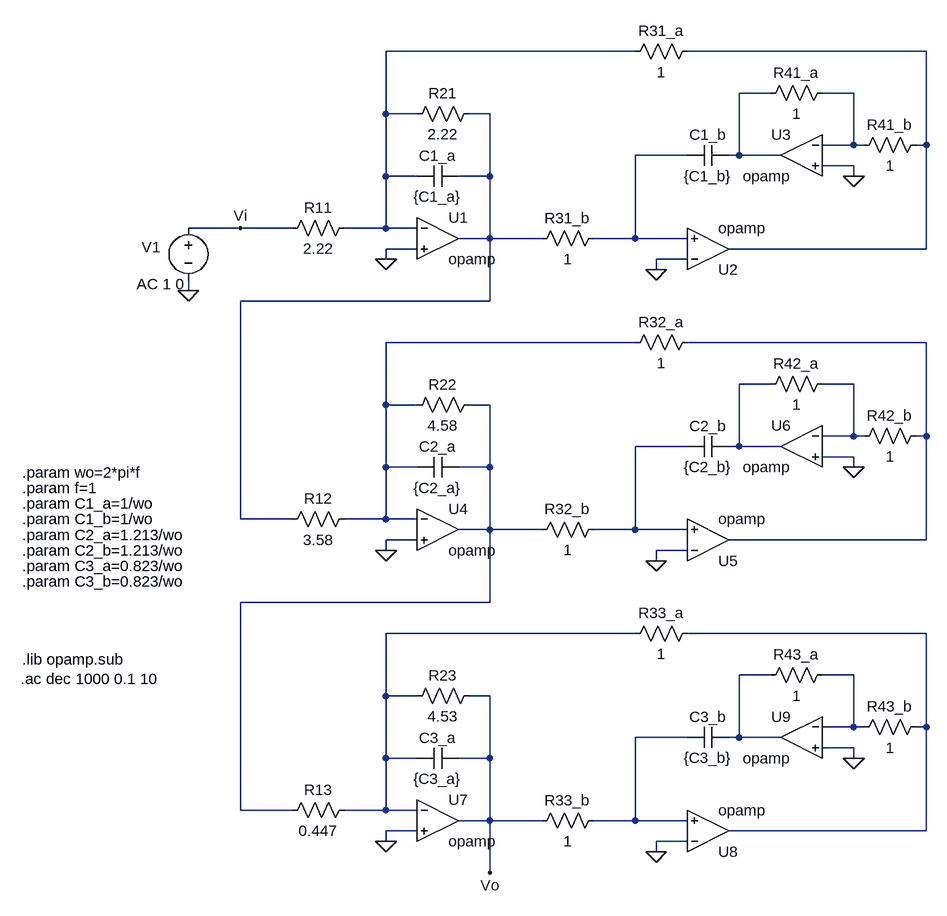
[diagram p0: schematic TS4_bis.asc]
TS4_bis.asc, the LTspice schematic file:
Version 4
SHEET 1 880 1344
WIRE 320 -16 -64 -16
WIRE 768 -16 400 -16
WIRE 528 48 480 48
WIRE 656 48 608 48
WIRE -64 80 -64 -16
WIRE -16 80 -64 80
WIRE 96 80 64 80
WIRE 656 128 656 48
WIRE 656 128 608 128
WIRE 672 128 656 128
WIRE 768 128 768 -16
WIRE 768 128 752 128
WIRE 400 144 320 144
WIRE 480 144 480 48
WIRE 480 144 464 144
WIRE 544 144 480 144
WIRE 656 160 608 160
WIRE -64 176 -64 80
WIRE -16 176 -64 176
WIRE 96 176 96 80
WIRE 96 176 48 176
WIRE 656 176 656 160
WIRE -288 256 -368 256
WIRE -208 256 -288 256
WIRE -64 256 -64 176
WIRE -64 256 -128 256
WIRE -16 256 -64 256
WIRE 96 272 96 176
WIRE 96 272 48 272
WIRE 176 272 96 272
WIRE 320 272 320 144
WIRE 320 272 256 272
WIRE 400 272 320 272
WIRE -16 288 -64 288
WIRE 768 288 768 128
WIRE 768 288 464 288
WIRE -64 304 -64 288
WIRE 400 304 352 304
WIRE 352 320 352 304
WIRE -368 352 -368 336
WIRE 96 368 96 272
WIRE 96 368 -288 368
WIRE 320 432 -64 432
WIRE 768 432 400 432
WIRE 528 496 480 496
WIRE 656 496 608 496
WIRE -64 528 -64 432
WIRE -16 528 -64 528
WIRE 96 528 64 528
WIRE 656 576 656 496
WIRE 656 576 608 576
WIRE 672 576 656 576
WIRE 768 576 768 432
WIRE 768 576 752 576
WIRE 400 592 320 592
WIRE 480 592 480 496
WIRE 480 592 464 592
WIRE 544 592 480 592
WIRE 656 608 608 608
WIRE -64 624 -64 528
WIRE -16 624 -64 624
WIRE 96 624 96 528
WIRE 96 624 48 624
WIRE 656 624 656 608
WIRE -288 704 -288 368
WIRE -208 704 -288 704
WIRE -64 704 -64 624
WIRE -64 704 -128 704
WIRE -16 704 -64 704
WIRE 96 720 96 624
WIRE 96 720 48 720
WIRE 176 720 96 720
WIRE 320 720 320 592
WIRE 320 720 256 720
WIRE 400 720 320 720
WIRE -16 736 -64 736
WIRE 768 736 768 576
WIRE 768 736 464 736
WIRE -64 752 -64 736
WIRE 400 752 352 752
WIRE 352 768 352 752
WIRE 96 832 96 720
WIRE 96 832 -288 832
WIRE 320 880 -64 880
WIRE 768 880 400 880
WIRE 528 944 480 944
WIRE 656 944 608 944
WIRE -64 976 -64 880
WIRE -16 976 -64 976
WIRE 96 976 64 976
WIRE 656 1024 656 944
WIRE 656 1024 608 1024
WIRE 672 1024 656 1024
WIRE 768 1024 768 880
WIRE 768 1024 752 1024
WIRE 400 1040 320 1040
WIRE 480 1040 480 944
WIRE 480 1040 464 1040
WIRE 544 1040 480 1040
WIRE 656 1056 608 1056
WIRE -64 1072 -64 976
WIRE -16 1072 -64 1072
WIRE 96 1072 96 976
WIRE 96 1072 48 1072
WIRE 656 1072 656 1056
WIRE -288 1152 -288 832
WIRE -208 1152 -288 1152
WIRE -64 1152 -64 1072
WIRE -64 1152 -128 1152
WIRE -16 1152 -64 1152
WIRE 96 1168 96 1072
WIRE 96 1168 48 1168
WIRE 176 1168 96 1168
WIRE 320 1168 320 1040
WIRE 320 1168 256 1168
WIRE 400 1168 320 1168
WIRE -16 1184 -64 1184
WIRE 768 1184 768 1024
WIRE 768 1184 464 1184
WIRE -64 1200 -64 1184
WIRE 400 1200 352 1200
WIRE 352 1216 352 1200
WIRE 96 1248 96 1168
FLAG -64 304 0
FLAG 352 320 0
FLAG 656 176 0
FLAG -64 752 0
FLAG 352 768 0
FLAG 656 624 0
FLAG -64 1200 0
FLAG 352 1216 0
FLAG 656 1072 0
FLAG 96 1248 Vo
FLAG -288 256 Vi
FLAG -368 352 0
SYMBOL cap 48 160 R90
WINDOW 0 0 32 VBottom 2
WINDOW 3 32 32 VTop 2
SYMATTR InstName C1_a
SYMATTR Value {C1_a}
SYMBOL res -112 240 R90
WINDOW 0 0 56 VBottom 2
WINDOW 3 32 56 VTop 2
SYMATTR InstName R11
SYMATTR Value 2.22
SYMBOL res 80 64 R90
WINDOW 0 0 56 VBottom 2
WINDOW 3 32 56 VTop 2
SYMATTR InstName R21
SYMATTR Value 2.22
SYMBOL res 416 -32 R90
WINDOW 0 0 56 VBottom 2
WINDOW 3 32 56 VTop 2
SYMATTR InstName R31_a
SYMATTR Value 1
SYMBOL res 272 256 R90
WINDOW 0 0 56 VBottom 2
WINDOW 3 32 56 VTop 2
SYMATTR InstName R31_b
SYMATTR Value 1
SYMBOL res 624 32 R90
WINDOW 0 0 56 VBottom 2
WINDOW 3 32 56 VTop 2
SYMATTR InstName R41_a
SYMATTR Value 1
SYMBOL res 768 112 R90
WINDOW 0 0 56 VBottom 2
WINDOW 3 32 56 VTop 2
SYMATTR InstName R41_b
SYMATTR Value 1
SYMBOL cap 400 128 M90
WINDOW 0 0 32 VBottom 2
WINDOW 3 32 32 VTop 2
SYMATTR InstName C1_b
SYMATTR Value {C1_b}
SYMBOL OpAmps\\opamp 16 208 R0
SYMATTR InstName U1
SYMBOL OpAmps\\opamp 432 352 M180
SYMATTR InstName U2
SYMBOL OpAmps\\opamp 576 80 M0
SYMATTR InstName U3
SYMBOL cap 48 608 R90
WINDOW 0 0 32 VBottom 2
WINDOW 3 32 32 VTop 2
SYMATTR InstName C2_a
SYMATTR Value {C2_a}
SYMBOL res -112 688 R90
WINDOW 0 0 56 VBottom 2
WINDOW 3 32 56 VTop 2
SYMATTR InstName R12
SYMATTR Value 3.58
SYMBOL res 80 512 R90
WINDOW 0 0 56 VBottom 2
WINDOW 3 32 56 VTop 2
SYMATTR InstName R22
SYMATTR Value 4.58
SYMBOL res 416 416 R90
WINDOW 0 0 56 VBottom 2
WINDOW 3 32 56 VTop 2
SYMATTR InstName R32_a
SYMATTR Value 1
SYMBOL res 272 704 R90
WINDOW 0 0 56 VBottom 2
WINDOW 3 32 56 VTop 2
SYMATTR InstName R32_b
SYMATTR Value 1
SYMBOL res 624 480 R90
WINDOW 0 0 56 VBottom 2
WINDOW 3 32 56 VTop 2
SYMATTR InstName R42_a
SYMATTR Value 1
SYMBOL res 768 560 R90
WINDOW 0 0 56 VBottom 2
WINDOW 3 32 56 VTop 2
SYMATTR InstName R42_b
SYMATTR Value 1
SYMBOL cap 400 576 M90
WINDOW 0 0 32 VBottom 2
WINDOW 3 32 32 VTop 2
SYMATTR InstName C2_b
SYMATTR Value {C2_b}
SYMBOL OpAmps\\opamp 16 656 R0
SYMATTR InstName U4
SYMBOL OpAmps\\opamp 432 800 M180
SYMATTR InstName U5
SYMBOL OpAmps\\opamp 576 528 M0
SYMATTR InstName U6
SYMBOL cap 48 1056 R90
WINDOW 0 0 32 VBottom 2
WINDOW 3 32 32 VTop 2
SYMATTR InstName C3_a
SYMATTR Value {C3_a}
SYMBOL res -112 1136 R90
WINDOW 0 0 56 VBottom 2
WINDOW 3 32 56 VTop 2
SYMATTR InstName R13
SYMATTR Value 0.447
SYMBOL res 80 960 R90
WINDOW 0 0 56 VBottom 2
WINDOW 3 32 56 VTop 2
SYMATTR InstName R23
SYMATTR Value 4.53
SYMBOL res 416 864 R90
WINDOW 0 0 56 VBottom 2
WINDOW 3 32 56 VTop 2
SYMATTR InstName R33_a
SYMATTR Value 1
SYMBOL res 272 1152 R90
WINDOW 0 0 56 VBottom 2
WINDOW 3 32 56 VTop 2
SYMATTR InstName R33_b
SYMATTR Value 1
SYMBOL res 624 928 R90
WINDOW 0 0 56 VBottom 2
WINDOW 3 32 56 VTop 2
SYMATTR InstName R43_a
SYMATTR Value 1
SYMBOL res 768 1008 R90
WINDOW 0 0 56 VBottom 2
WINDOW 3 32 56 VTop 2
SYMATTR InstName R43_b
SYMATTR Value 1
SYMBOL cap 400 1024 M90
WINDOW 0 0 32 VBottom 2
WINDOW 3 32 32 VTop 2
SYMATTR InstName C3_b
SYMATTR Value {C3_b}
SYMBOL OpAmps\\opamp 16 1104 R0
SYMATTR InstName U7
SYMBOL OpAmps\\opamp 432 1248 M180
SYMATTR InstName U8
SYMBOL OpAmps\\opamp 576 976 M0
SYMATTR InstName U9
SYMBOL voltage -368 240 R0
WINDOW 0 -72 45 Left 2
WINDOW 3 -80 74 Left 2
WINDOW 123 -80 102 Left 2
WINDOW 39 0 0 Left 0
SYMATTR InstName V1
SYMATTR Value ""
SYMATTR Value2 AC 1 0
TEXT -624 680 Left 2 !.param C1_a=1/wo
TEXT -624 632 Left 2 !.param wo=2*pi*f
TEXT -624 656 Left 2 !.param f=1
TEXT -624 704 Left 2 !.param C1_b=1/wo
TEXT -624 728 Left 2 !.param C2_a=1.213/wo
TEXT -624 752 Left 2 !.param C2_b=1.213/wo
TEXT -624 776 Left 2 !.param C3_a=0.823/wo
TEXT -624 800 Left 2 !.param C3_b=0.823/wo
TEXT -626 950 Left 2 !.ac dec 1000 0.1 10
TEXT -624 920 Left 2 !.lib opamp.sub

The netlist it stands for:
* TS4_bis.asc
C1_a N005 N001 {C1_a}
R11 N001 Vi 2.22
R21 N005 N001 2.22
R31_a N002 N001 1
R31_b N006 N005 1
R41_a N004 N003 1
R41_b N002 N004 1
C1_b N006 N003 {C1_b}
XU1 N001 0 N005 opamp Aol=100K GBW=10Meg  ; pins invin noninvin out
XU2 0 N006 N002 opamp Aol=100K GBW=10Meg  ; pins invin noninvin out
XU3 N004 0 N003 opamp Aol=100K GBW=10Meg  ; pins invin noninvin out
C2_a N011 N007 {C2_a}
R12 N007 N005 3.58
R22 N011 N007 4.58
R32_a N008 N007 1
R32_b N012 N011 1
R42_a N010 N009 1
R42_b N008 N010 1
C2_b N012 N009 {C2_b}
XU4 N007 0 N011 opamp Aol=100K GBW=10Meg  ; pins invin noninvin out
XU5 0 N012 N008 opamp Aol=100K GBW=10Meg  ; pins invin noninvin out
XU6 N010 0 N009 opamp Aol=100K GBW=10Meg  ; pins invin noninvin out
C3_a Vo N013 {C3_a}
R13 N013 N011 0.447
R23 Vo N013 4.53
R33_a N014 N013 1
R33_b N017 Vo 1
R43_a N016 N015 1
R43_b N014 N016 1
C3_b N017 N015 {C3_b}
XU7 N013 0 Vo opamp Aol=100K GBW=10Meg  ; pins invin noninvin out
XU8 0 N017 N014 opamp Aol=100K GBW=10Meg  ; pins invin noninvin out
XU9 N016 0 N015 opamp Aol=100K GBW=10Meg  ; pins invin noninvin out
V1 Vi 0 AC 1 0
.param C1_a=1/wo
.param wo=2*pi*f
.param f=1
.param C1_b=1/wo
.param C2_a=1.213/wo
.param C2_b=1.213/wo
.param C3_a=0.823/wo
.param C3_b=0.823/wo
.ac dec 1000 0.1 10
.lib opamp.sub
.backanno
.end